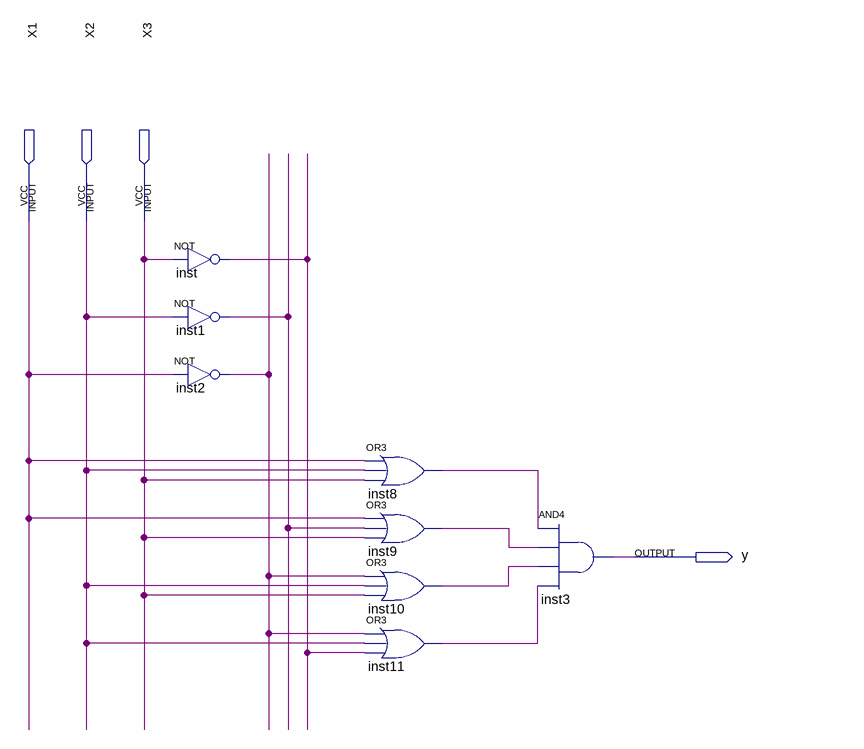
[diagram p0: schematic sheet]
// Quartus schematic lab2_2.bdf as structural Verilog: 8 symbols, 4 pins
module lab2_2 (
  input  X1,
  input  X2,
  input  X3,
  output y
);

  wire inst1_out, inst2_out, inst8_out, inst9_out, inst10_out, inst11_out, inst_out;

  not inst (inst_out, X3);
  not inst1 (inst1_out, X2);
  not inst2 (inst2_out, X1);
  or inst8 (inst8_out, X1, X2, X3);
  or inst9 (inst9_out, X1, inst1_out, X3);
  or inst10 (inst10_out, inst2_out, X2, X3);
  or inst11 (inst11_out, inst2_out, X2, inst_out);
  and inst3 (y, inst8_out, inst9_out, inst10_out, inst11_out);
endmodule
